# EAGLE design OSSIBeacon (EAGLE 6.1)

## Sheet 1 of 3
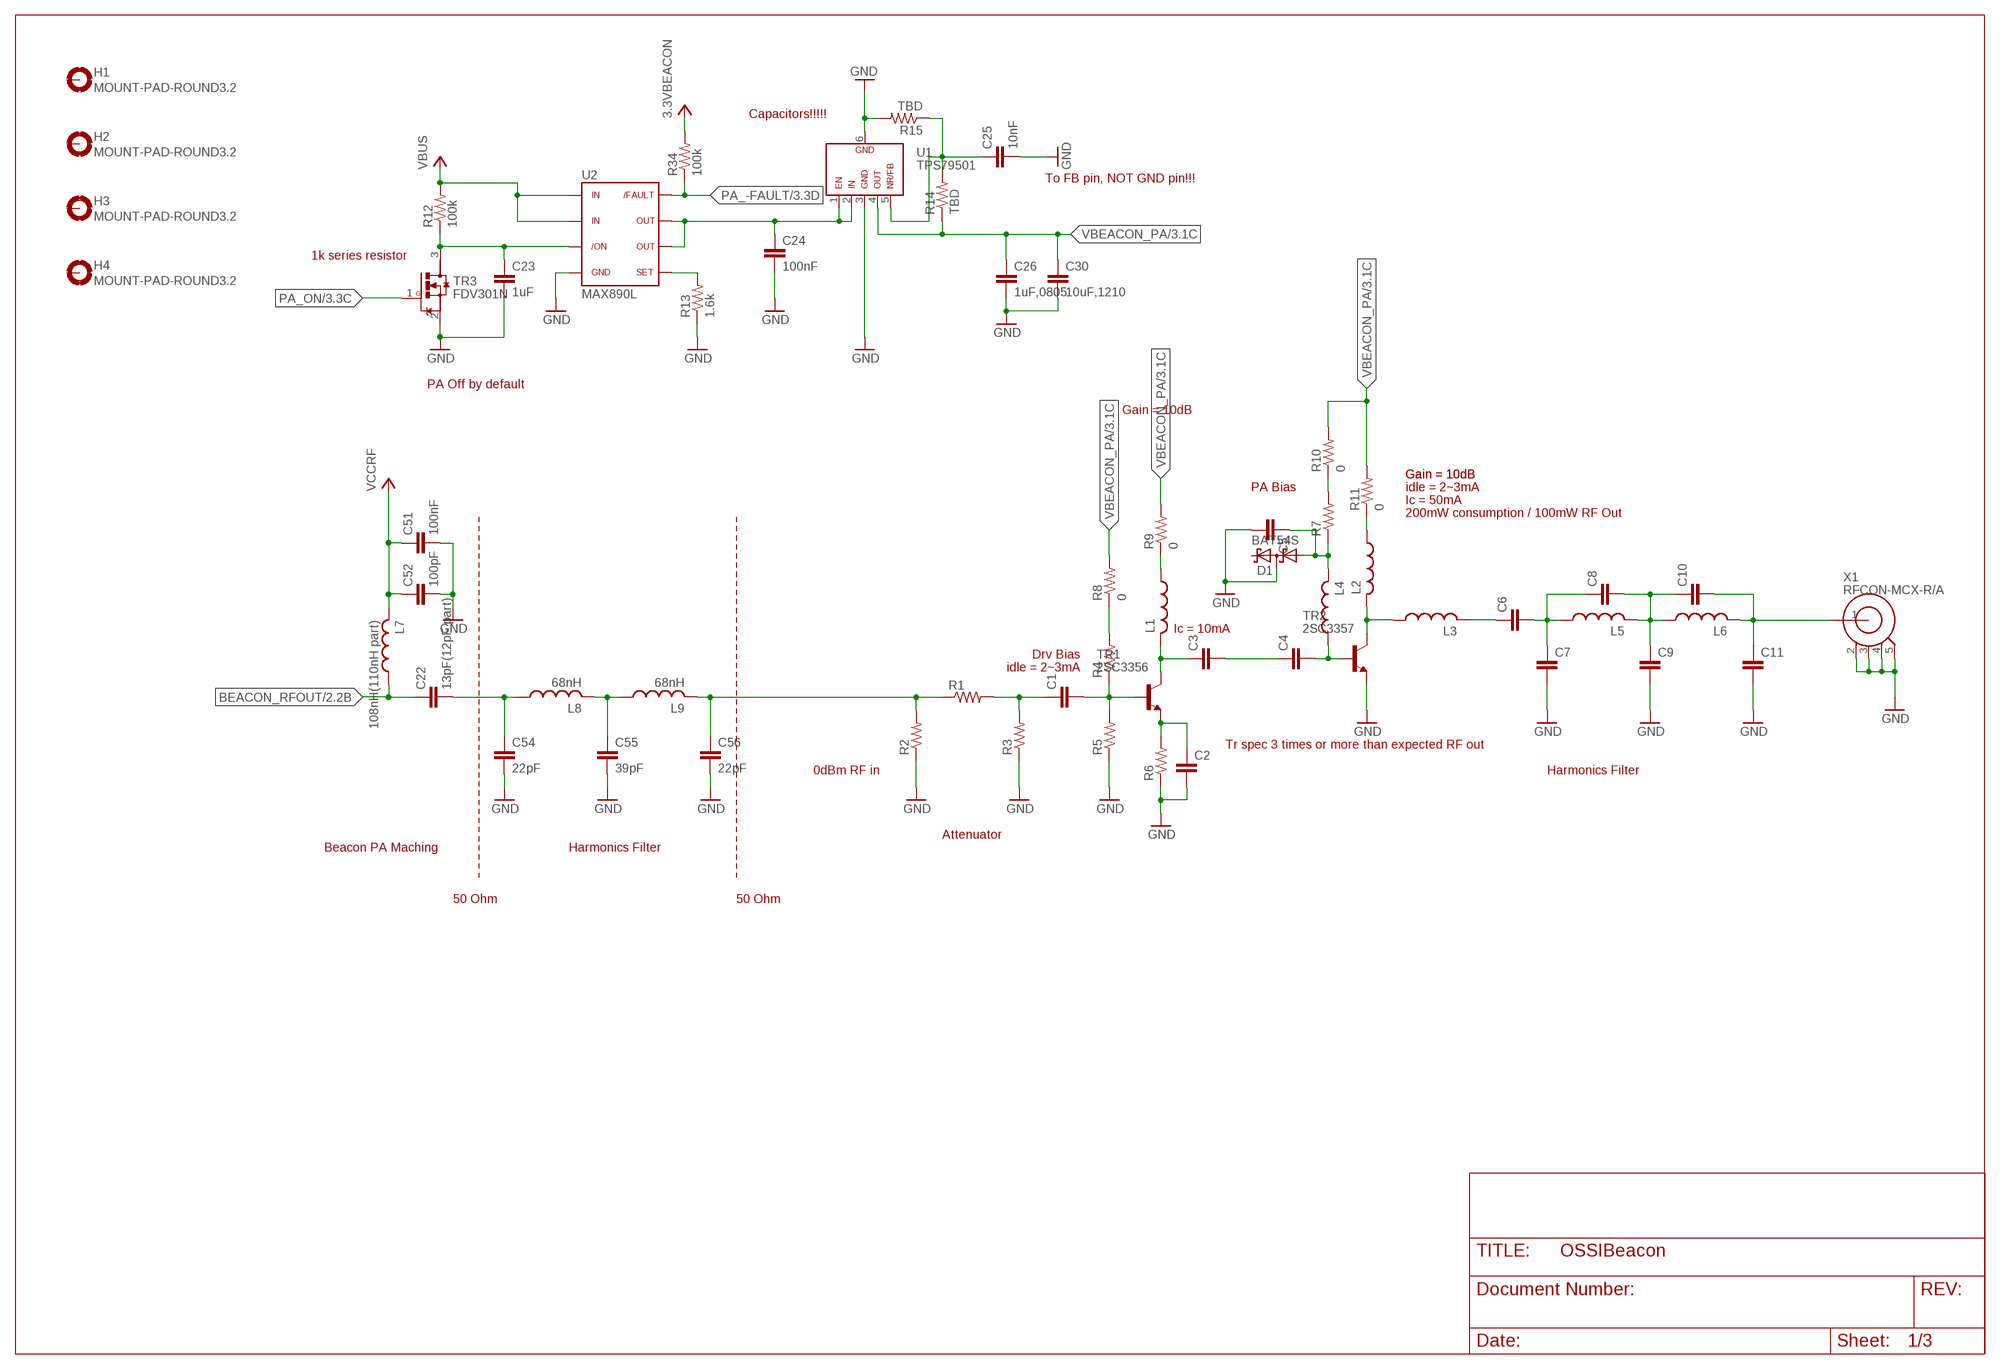
[diagram p0: schematic, sheet 1]

### Parts
C1  C0603(1608)  [C0603(1608)]
C2  C0603(1608)  [C0603(1608)]
C3  C0603(1608)  [C0603(1608)]
C4  C0603(1608)  [C0603(1608)]
C5  C0603(1608)  [C0603(1608)]
C6  C0603(1608)  [C0603(1608)]
C7  C0603(1608)  [C0603(1608)]
C8  C0603(1608)  [C0603(1608)]
C9  C0603(1608)  [C0603(1608)]
C10  C0603(1608)  [C0603(1608)]
C11  C0603(1608)  [C0603(1608)]
C22  13pF(12pF part)  C0603(1608)  [C0603(1608)]
C23  1uF  C0603(1608)  [C0603(1608)]
C24  100nF  C0603(1608)  [C0603(1608)]
C25  10nF  C0603(1608)  [C0603(1608)]
C26  1uF,0805  C0805(2012)  [C0805(2012)]
C30  10uF,1210  C1210(3225)-GCM32  [C1210-GCM32]
C51  100nF  C0603(1608)  [C0603(1608)]
C52  100pF  C0603(1608)  [C0603(1608)]
C54  22pF  C0603(1608)  [C0603(1608)]
C55  39pF  C0603(1608)  [C0603(1608)]
C56  22pF  C0603(1608)  [C0603(1608)]
D1  BAT54S  [SOT23]
H1  MOUNT-PAD-ROUND3.2  [3.2-PAD-ROUND]
H2  MOUNT-PAD-ROUND3.2  [3.2-PAD-ROUND]
H3  MOUNT-PAD-ROUND3.2  [3.2-PAD-ROUND]
H4  MOUNT-PAD-ROUND3.2  [3.2-PAD-ROUND]
L1  L1008(2502)  [L1008(2520)]
L2  L1008(2502)  [L1008(2520)]
L3  L0603(1608)  [L0603(1608)]
L4  L0603(1608)  [L0603(1608)]
L5  L0603(1608)  [L0603(1608)]
L6  L0603(1608)  [L0603(1608)]
L7  108nH(110nH part)  L0603(1608)  [L0603(1608)]
L8  68nH  L0603(1608)  [L0603(1608)]
L9  68nH  L0603(1608)  [L0603(1608)]
R1  R0603(1608)  [R0603(1608)]
R2  R0603(1608)  [R0603(1608)]
R3  R0603(1608)  [R0603(1608)]
R4  R0603(1608)  [R0603(1608)]
R5  R0603(1608)  [R0603(1608)]
R6  R0603(1608)  [R0603(1608)]
R7  R0603(1608)  [R0603(1608)]
R8  0  R0603(1608)  [R0603(1608)]
R9  0  R0603(1608)  [R0603(1608)]
R10  0  R0603(1608)  [R0603(1608)]
R11  0  R0603(1608)  [R0603(1608)]
R12  100k  R0603(1608)  [R0603(1608)]
R13  1.6k  R0603(1608)  [R0603(1608)]
R14  TBD  R0603(1608)  [R0603(1608)]
R15  TBD  R0603(1608)  [R0603(1608)]
R34  100k  R0603(1608)  [R0603(1608)]
TR1  2SC3356  [SOT23-BEC]
TR2  2SC3357  [SOT89-R]
TR3  FDV301N  [SOT23]
U1  TPS79501  [SOT223-6]
U2  MAX890L  [SO8]
X1  RFCON-MCX-R/A  [MCX-R/A]

### Nets
3.3VBEACON: R34.2 ; also sheet 3
BEACON_RFOUT: C22.1 L7.1 ; also sheet 2
GND: C2.2 C5.2 C7.2 C9.2 C11.2 C23.2 C24.2 C25.2 C26.2 C30.P$2 C51.2 C52.2 C54.2 C55.2 C56.2 D1.3(C1A2) R2.1 R3.1 R5.1 R6.1 R13.1 R15.2 TR2.E TR3.2(S) U1.3 U1.6 U2.4 X1.2 X1.3 X1.4 X1.5 ; also sheet 2,3
N$2: C1.1 R1.2 R3.2
N$3: C1.2 R4.1 R5.2 TR1.B
N$4: C3.1 L1.P$2 TR1.C
N$5: C2.1 R6.2 TR1.E
N$6: C3.2 C4.1
N$7: C4.2 L4.1 TR2.B
N$8: C5.1 D1.1(A1) L4.2 R7.1
N$9: L2.P$2 L3.1 TR2.C
N$10: C6.1 L3.2
N$11: C6.2 C7.1 C8.1 L5.1
N$12: C8.2 C9.1 C10.1 L5.2 L6.1
N$13: C10.2 C11.1 L6.2 X1.1
N$14: R4.2 R8.1
N$15: L1.P$1 R9.1
N$16: R7.2 R10.1
N$17: L2.P$1 R11.1
N$18: C25.1 R14.2 R15.1 U1.5
N$19: C23.1 R12.1 TR3.3(D) U2.3
N$20: C24.1 U1.1 U1.2 U2.6 U2.7
N$21: R13.2 U2.5
N$42: C22.2 C54.1 L8.1
N$43: C55.1 L8.2 L9.1
N$44: C56.1 L9.2 R1.1 R2.2
PA_-FAULT: R34.1 U2.8 ; also sheet 3
PA_ON: TR3.1(G) ; also sheet 3
VBEACON_PA: C26.1 C30.P$1 R8.2 R9.2 R10.2 R11.2 R14.1 U1.4 ; also sheet 3
VBUS: R12.2 U2.1 U2.2 ; also sheet 3
VCCRF: C51.1 C52.1 L7.2 ; also sheet 2,3
Unconnected: D1.2(C2) H1.B3,2(MOUNT) H2.B3,2(MOUNT) H3.B3,2(MOUNT) H4.B3,2(MOUNT)

### Notes on the sheet
- Capacitors!!!!!
- To FB pin, NOT GND pin!!!
- 1k series resistor
- PA Off by default
- Gain = 10dB
- Gain = 10dB | Gain = 10dB
- PA Bias | idle = 2~3mA
- Ic = 50mA
- 200mW consumption / 100mW RF Out
- Ic = 10mA
- Drv Bias
- idle = 2~3mA
- Tr spec 3 times or more than expected RF out
- 0dBm RF in | Harmonics Filter
- Attenuator
- Beacon PA Maching | Harmonics Filter
- 50 Ohm | 50 Ohm

## Sheet 2 of 3
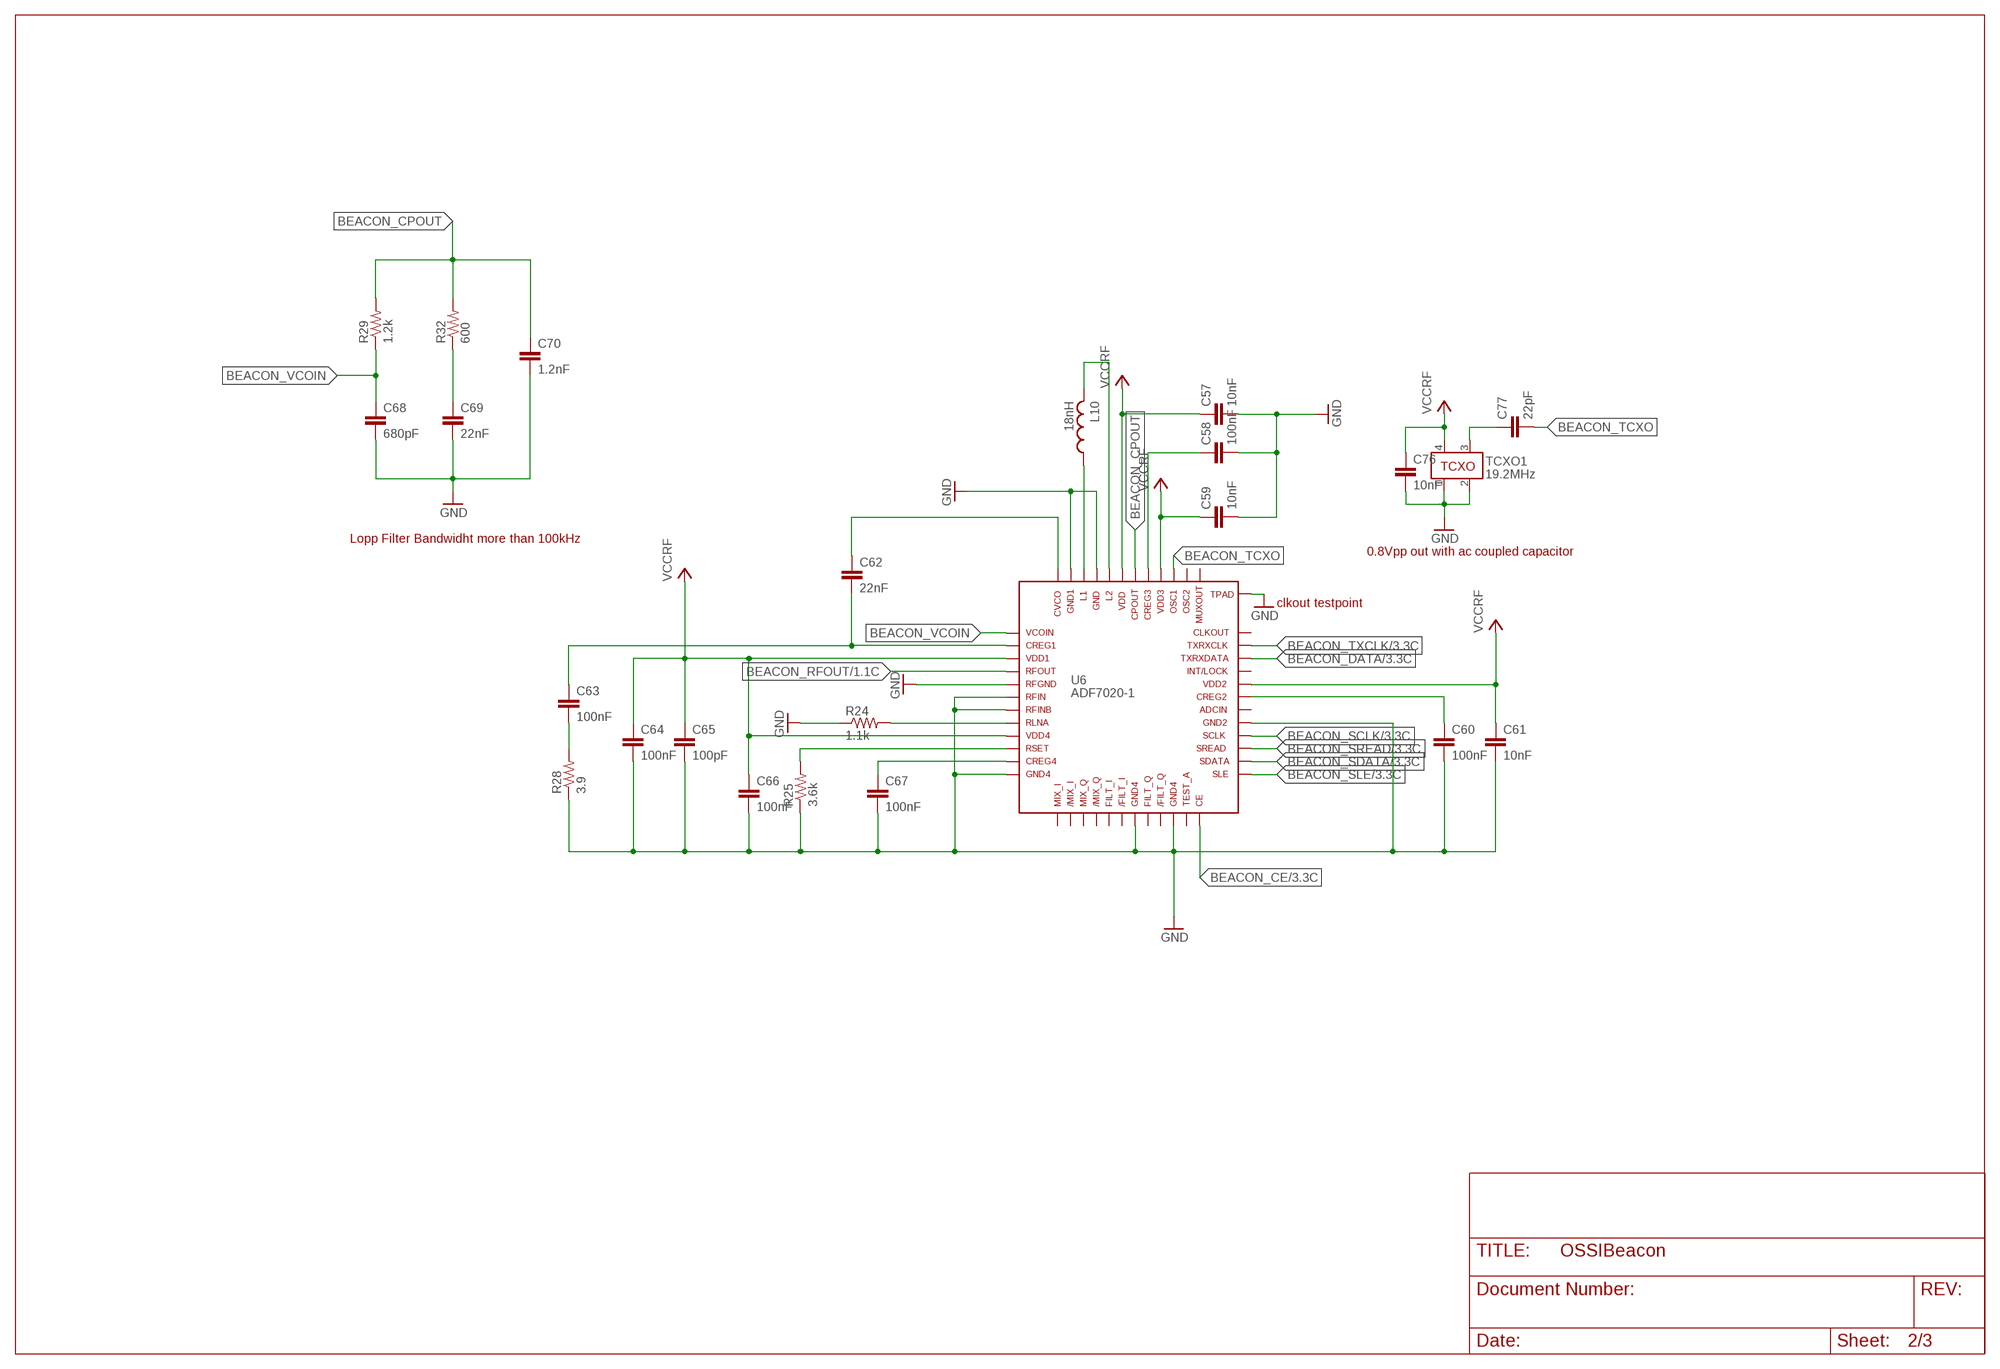
[diagram p1: schematic, sheet 2]

### Parts
C57  10nF  C0603(1608)  [C0603(1608)]
C58  100nF  C0603(1608)  [C0603(1608)]
C59  10nF  C0603(1608)  [C0603(1608)]
C60  100nF  C0603(1608)  [C0603(1608)]
C61  10nF  C0603(1608)  [C0603(1608)]
C62  22nF  C0603(1608)  [C0603(1608)]
C63  100nF  C0603(1608)  [C0603(1608)]
C64  100nF  C0603(1608)  [C0603(1608)]
C65  100pF  C0603(1608)  [C0603(1608)]
C66  100nF  C0603(1608)  [C0603(1608)]
C67  100nF  C0603(1608)  [C0603(1608)]
C68  680pF  C0603(1608)  [C0603(1608)]
C69  22nF  C0603(1608)  [C0603(1608)]
C70  1.2nF  C0603(1608)  [C0603(1608)]
C76  10nF  C0603(1608)  [C0603(1608)]
C77  22pF  C0603(1608)  [C0603(1608)]
L10  18nH  L0603(1608)  [L0603(1608)]
R24  1.1k  R0603(1608)  [R0603(1608)]
R25  3.6k  R0603(1608)  [R0603(1608)]
R28  3.9  R0603(1608)  [R0603(1608)]
R29  1.2k  R0603(1608)  [R0603(1608)]
R32  600  R0603(1608)  [R0603(1608)]
TCXO1  19.2MHz  TCXO-M532  [TCXO_M532]
U6  ADF7020-1  [LFCSP48]

### Nets
BEACON_CE: U6.24 ; also sheet 3
BEACON_CPOUT: C70.1 R29.2 R32.2 U6.42
BEACON_DATA: U6.34 ; also sheet 3
BEACON_RFOUT: U6.4 ; also sheet 1
BEACON_SCLK: U6.28 ; also sheet 3
BEACON_SDATA: U6.26 ; also sheet 3
BEACON_SLE: U6.25 ; also sheet 3
BEACON_SREAD: U6.27 ; also sheet 3
BEACON_TCXO: C77.2 U6.39
BEACON_TXCLK: U6.35 ; also sheet 3
BEACON_VCOIN: C68.1 R29.1 U6.1
GND: C57.2 C58.2 C59.2 C60.2 C61.2 C64.2 C65.2 C66.2 C67.2 C68.2 C69.2 C70.2 C76.2 R24.1 R25.1 R28.1 TCXO1.1 TCXO1.2 U6.5 U6.6 U6.7 U6.12 U6.19 U6.22 U6.29 U6.45 U6.47 U6.EXP ; also sheet 1,3
N$45: C62.1 U6.48
N$46: C63.2 R28.2
N$47: C60.1 U6.31
N$48: C67.1 U6.11
N$49: R25.2 U6.10
N$50: R24.2 U6.8
N$51: C58.1 U6.41
N$52: C62.2 C63.1 U6.2
N$53: C69.1 R32.1
N$54: L10.1 U6.46
N$55: L10.2 U6.44
N$69: C77.1 TCXO1.3
VCCRF: C57.1 C59.1 C61.1 C64.1 C65.1 C66.1 C76.1 TCXO1.4 U6.3 U6.9 U6.32 U6.40 U6.43 ; also sheet 1,3
Unconnected: U6.13 U6.14 U6.15 U6.16 U6.17 U6.18 U6.20 U6.21 U6.23 U6.30 U6.33 U6.36 U6.37 U6.38

### Notes on the sheet
- Lopp Filter Bandwidht more than 100kHz
- 0.8Vpp out with ac coupled capacitor
- clkout testpoint

## Sheet 3 of 3
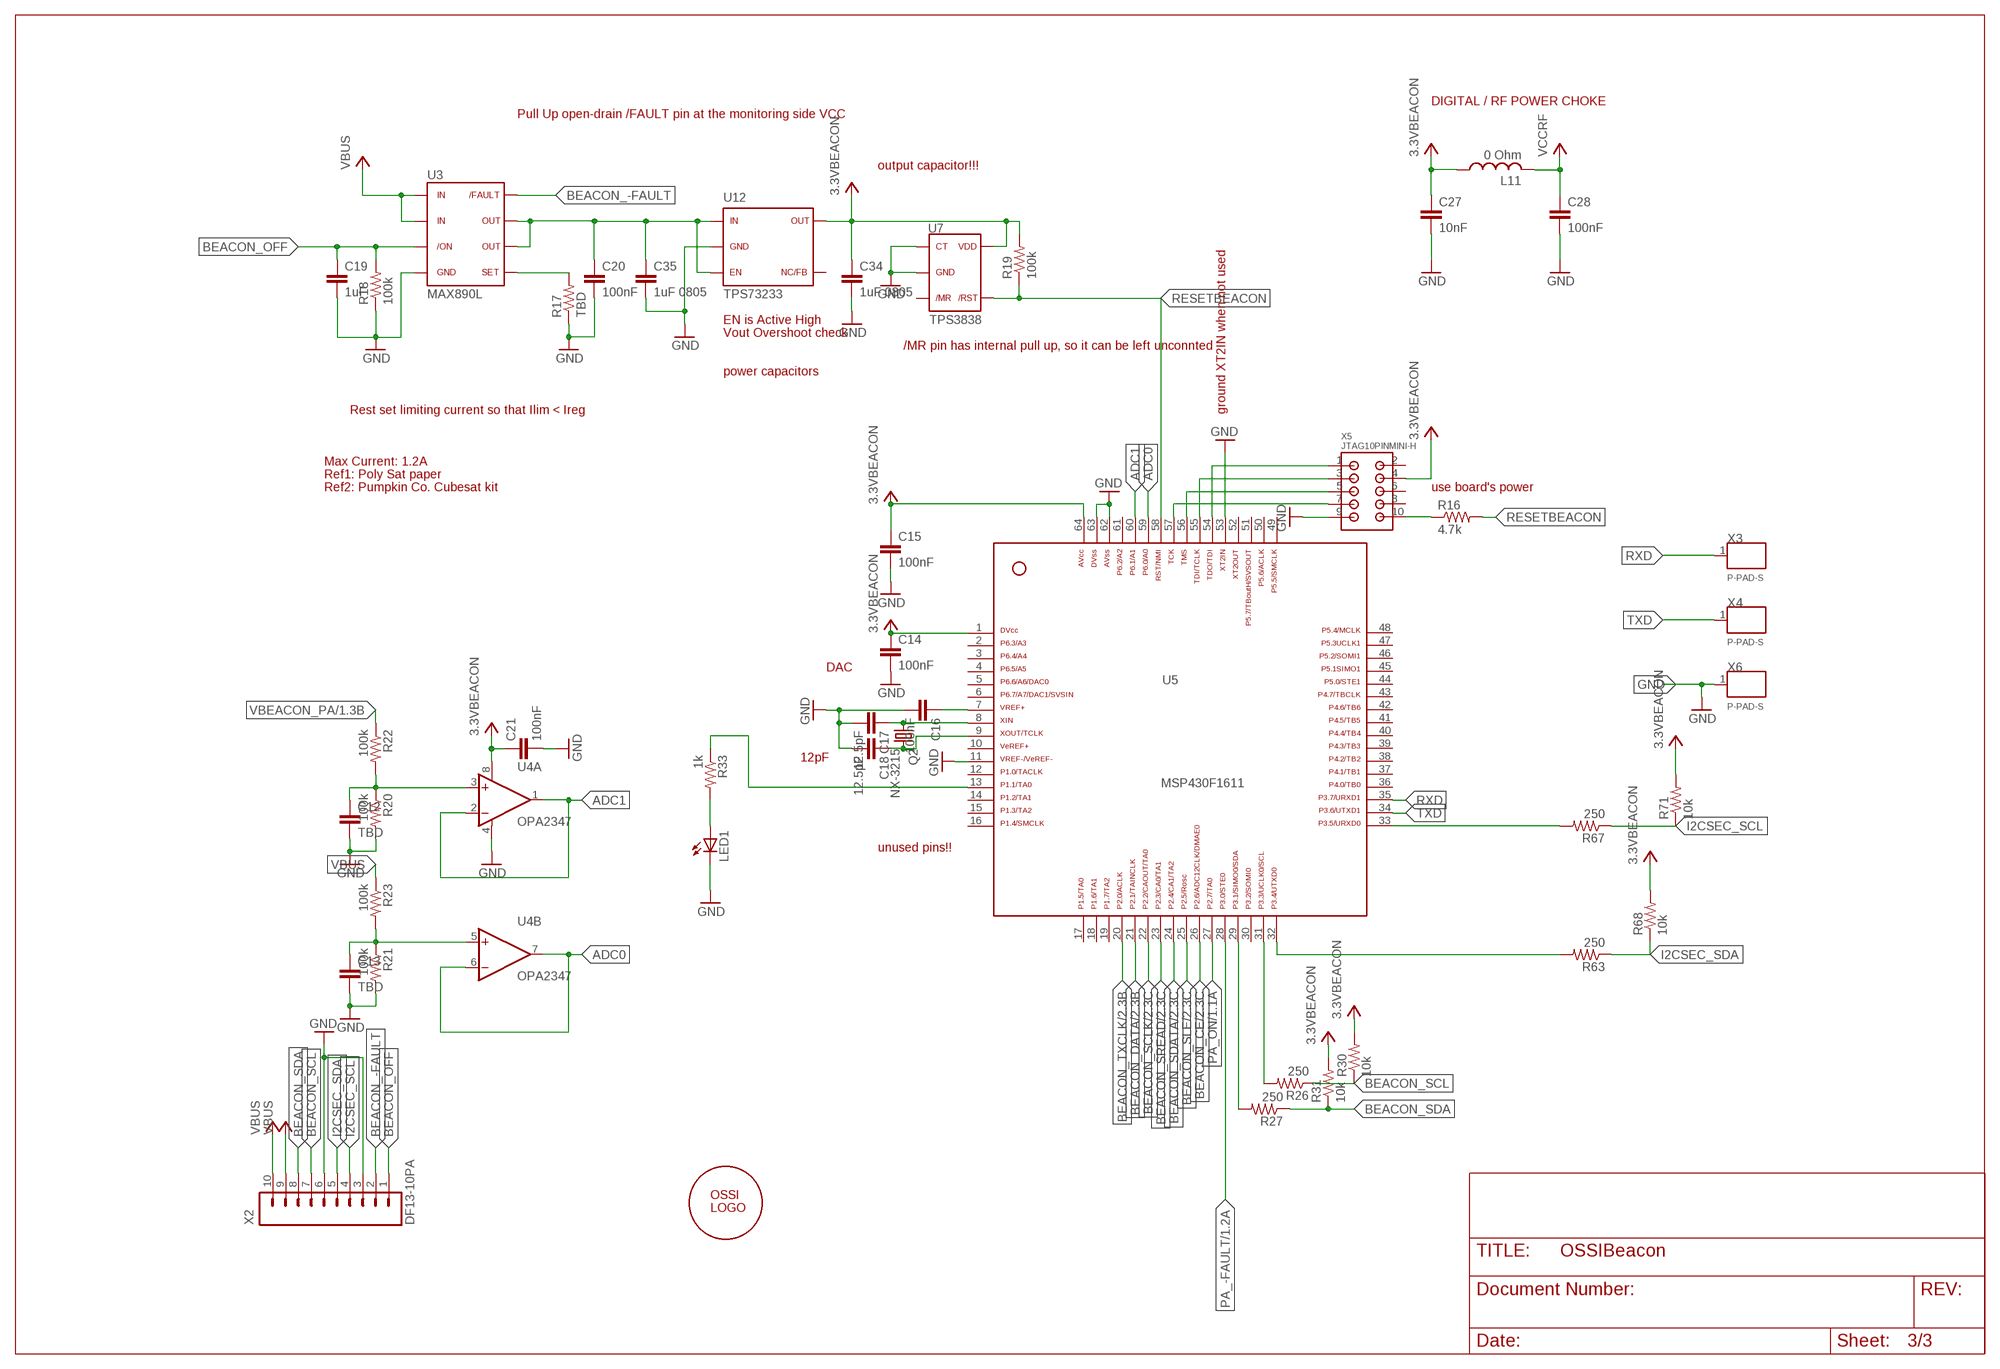
[diagram p2: schematic, sheet 3]

### Parts
C12  TBD  C0603(1608)  [C0603(1608)]
C13  TBD  C0603(1608)  [C0603(1608)]
C14  100nF  C0603(1608)  [C0603(1608)]
C15  100nF  C0603(1608)  [C0603(1608)]
C16  100nF  C0603(1608)  [C0603(1608)]
C17  12.5pF  C0603(1608)  [C0603(1608)]
C18  12.5pF  C0603(1608)  [C0603(1608)]
C19  1uF  C0603(1608)  [C0603(1608)]
C20  100nF  C0603(1608)  [C0603(1608)]
C21  100nF  C0603(1608)  [C0603(1608)]
C27  10nF  C0603(1608)  [C0603(1608)]
C28  100nF  C0603(1608)  [C0603(1608)]
C34  1uF 0805  C0805(2012)  [C0805(2012)]
C35  1uF 0805  C0805(2012)  [C0805(2012)]
L11  0 Ohm  L0805(2012)  [L0805(2012)]
LED1  LED0603  [LED-0603]
Q2  NX-3215  [NX-3215]
R16  4.7k  R0603(1608)  [R0603(1608)]
R17  TBD  R0603(1608)  [R0603(1608)]
R18  100k  R0603(1608)  [R0603(1608)]
R19  100k  R0603(1608)  [R0603(1608)]
R20  100k  R0603(1608)  [R0603(1608)]
R21  100k  R0603(1608)  [R0603(1608)]
R22  100k  R0603(1608)  [R0603(1608)]
R23  100k  R0603(1608)  [R0603(1608)]
R26  250  R0603(1608)  [R0603(1608)]
R27  250  R0603(1608)  [R0603(1608)]
R30  10k  R0603(1608)  [R0603(1608)]
R31  10k  R0603(1608)  [R0603(1608)]
R33  1k  R0603(1608)  [R0603(1608)]
R63  250  R0603(1608)  [R0603(1608)]
R67  250  R0603(1608)  [R0603(1608)]
R68  10k  R0603(1608)  [R0603(1608)]
R71  10k  R0603(1608)  [R0603(1608)]
U3  MAX890L  [SO8]
U4  OPA2347  [SOT23-8DCN]
U5  MSP430F1611  [PM/PAG64]
U7  TPS3838  [SOT23-5DBV]
U12  TPS73233  [SOT23-5DBV]
U$1  OSSILOGORECT  [OSSILOGORECT1005]
X2  DF13-10PA  [DF13A-10P]
X3  P-PAD-S  [P-PAD-S]
X4  P-PAD-S  [P-PAD-S]
X5  JTAG10PINMINI-H  [M50-3200545]
X6  P-PAD-S  [P-PAD-S]

### Nets
3.3VBEACON: C14.1 C15.1 C21.1 C27.1 C34.1 L11.1 R19.2 R30.2 R31.2 R68.2 R71.2 U4.8(A:V+) U5.1 U5.64 U7.5 U12.5 X5.4 ; also sheet 1
ADC0: U4.6(B:-IN) U4.7(B:OUT) U5.59
ADC1: U4.1(A:OUT) U4.2(A:-IN) U5.60
BEACON_-FAULT: U3.8 X2.2
BEACON_CE: U5.26 ; also sheet 2
BEACON_DATA: U5.21 ; also sheet 2
BEACON_OFF: C19.1 R18.2 U3.3 X2.1
BEACON_SCL: R26.1 R30.1 X2.7
BEACON_SCLK: U5.22 ; also sheet 2
BEACON_SDA: R27.1 R31.1 X2.8
BEACON_SDATA: U5.24 ; also sheet 2
BEACON_SLE: U5.25 ; also sheet 2
BEACON_SREAD: U5.23 ; also sheet 2
BEACON_TXCLK: U5.20 ; also sheet 2
GND: C12.2 C13.2 C14.2 C15.2 C16.2 C17.2 C18.2 C19.2 C20.2 C21.2 C27.2 C28.2 C34.2 C35.2 LED1.C R17.1 R18.1 R20.2 R21.2 U3.4 U4.4(A:V-) U5.11 U5.53 U5.62 U5.63 U7.1 U7.2 U12.2 X2.3 X2.6 X5.9 X6.1 ; also sheet 1,2
I2CSEC_SCL: R67.1 R71.1 X2.4
I2CSEC_SDA: R63.1 R68.1 X2.5
N$1: LED1.A R33.2
N$22: C13.1 R21.1 R23.2 U4.5(B:+IN)
N$23: C16.1 U5.7
N$24: R33.1 U5.13
N$25: C17.1 Q2.1 U5.8
N$26: C18.1 Q2.2 U5.9
N$27: U5.57 X5.7
N$28: U5.56 X5.5
N$29: U5.55 X5.3
N$30: U5.54 X5.1
N$31: R16.1 X5.10
N$32: R17.2 U3.5
N$33: C12.1 R20.1 R22.2 U4.3(A:+IN)
N$59: R67.2 U5.33
N$60: R27.2 U5.29
N$61: R26.2 U5.31
N$64: R63.2 U5.32
N$666: C20.1 C35.1 U3.6 U3.7 U12.1 U12.3
PA_-FAULT: U5.28 ; also sheet 1
PA_ON: U5.27 ; also sheet 1
RESETBEACON: R16.2 R19.1 U5.58 U7.4
RXD: U5.35 X3.1
TXD: U5.34 X4.1
VBEACON_PA: R22.1 ; also sheet 1
VBUS: R23.1 U3.1 U3.2 X2.9 X2.10 ; also sheet 1
VCCRF: C28.1 L11.2 ; also sheet 1,2
Unconnected: U5.2 U5.3 U5.4 U5.5 U5.6 U5.10 U5.12 U5.14 U5.15 U5.16 U5.17 U5.18 U5.19 U5.30 U5.36 U5.37 U5.38 U5.39 U5.40 U5.41 U5.42 U5.43 U5.44 U5.45 U5.46 U5.47 U5.48 U5.49 U5.50 U5.51 U5.52 U5.61 U7.3 U12.4 X5.2 X5.6 X5.8

### Notes on the sheet
- DIGITAL / RF POWER CHOKE
- Pull Up open-drain /FAULT pin at the monitoring side VCC
- output capacitor!!!
- EN is Active High
- Vout Overshoot check
- /MR pin has internal pull up, so it can be left unconnted
- power capacitors
- Rest set limiting current so that Ilim < Ireg | ground XT2IN when not used
- Max Current: 1.2A
- Ref1: Poly Sat paper
- Ref2: Pumpkin Co. Cubesat kit | use board's power
- DAC
- 12pF
- unused pins!!

## Library data of the parts
C1-C28 C30 C34 C35 C51 C52 C54-C70 C76 C77 = OSSI:C
D1 = OSSI:BAT54S: Schottky Diodes Pin connection corrected 2011-05-04 Source: Fairchild .. BAT54.pdf
H1-H4 = OSSI:MOUNT-PAD-ROUND
L1-L11 = OSSI:L
LED1 = SparkFun:LED: LEDs Standard schematic elements and footprints for 5mm, 3mm, 1206, and 0603 sized LEDs. 5mm - Spark Fun Electronics SKU : COM-00529 (and others)
Q2 = OSSI:NX-3215: NDK 32.768 kHz SMD Crystal P/N: NX3215SA-32.768K-STD-MUA-9 Nominal frequency (kHz): 32.768 Package Size (L×W×H : mm): 3.2×1.5×0.8 Operating Temperature Range(*1) / Storage Temperature Range (°C): -40 to +85 / -40 to +85 Level of drive: 0.1µW (Max. 0.5µW) Frequency Tolerance (25±3°C): ±20×10-6 Load Capacitance: 9.0pF, 12.5pF Equivalent Series Resistance: 70kΩ Max. Ordering Code: NX3215SA-32.768K-STD-MUA-9 (Load Capacitance9.0pF) /NX3215SA-32.768K-STD-MUA-8 (Load Capacitance12.5pF)
R1-R34 R63 R67 R68 R71 = OSSI:R
TCXO1 = OSSI:TCXO-M532: 532L25DT19M2000: CTO electronic components Model 532 19.2MHz TCXO for RF transeiver Clipped Sine Wave Output Operating Voltage, +3.3Vdc Operating Temperature to -30°C to +85°C Frequency Stability: ±2.5ppm
TR1 = OSSI:2SC3356
TR2 = OSSI:2SC3357
TR3 = OSSI:FDV301N: FDV301N Digital N channel - FET / Rdson = 5 Ohm / Vgs = 0.7~1.06V / Ids = 220mA
U1 = OSSI:TPS795*: TPS795xx ULTRALOW-NOISE, HIGH-PSRR, FAST, RF, 500-mA LOW-DROPOUT LINEAR REGULATORS
U2 U3 = OSSI:MAX890L: MAX 890L 1.2A, Current-Limited, High-Side P-Channel Switch with Thermal Shutdown BY MAXIM
U4 = OSSI:OPA2347: OPA2347 RAIL-TO-RAIL INPUT AND OUTPUT SINGLE SUPPLY: 2.3V to 5.5V LOW IQ: 20µ
U5 = OSSI:MSP430F1611: MSP430F1611
U6 = OSSI:ADF7020-1: ADF7020-1 RF transceiver by analog device
U7 = OSSI:TPS3838: TPS3838 NanoPower Supervisory IC from texas instruments. TPS3838 is open-drain output
U12 = OSSI:TPS732*: TPS732XX LDO 250mA / 40mV drop out EN pin is Active High!!
U$1 = OSSI:OSSILOGO
X1 = OSSI:RFCON: RF Connectors
X2 = OSSI:DF13-10P
X3 X4 X6 = OSSI:P-PAD
X5 = OSSI:JTAG10PINMINI

## Board
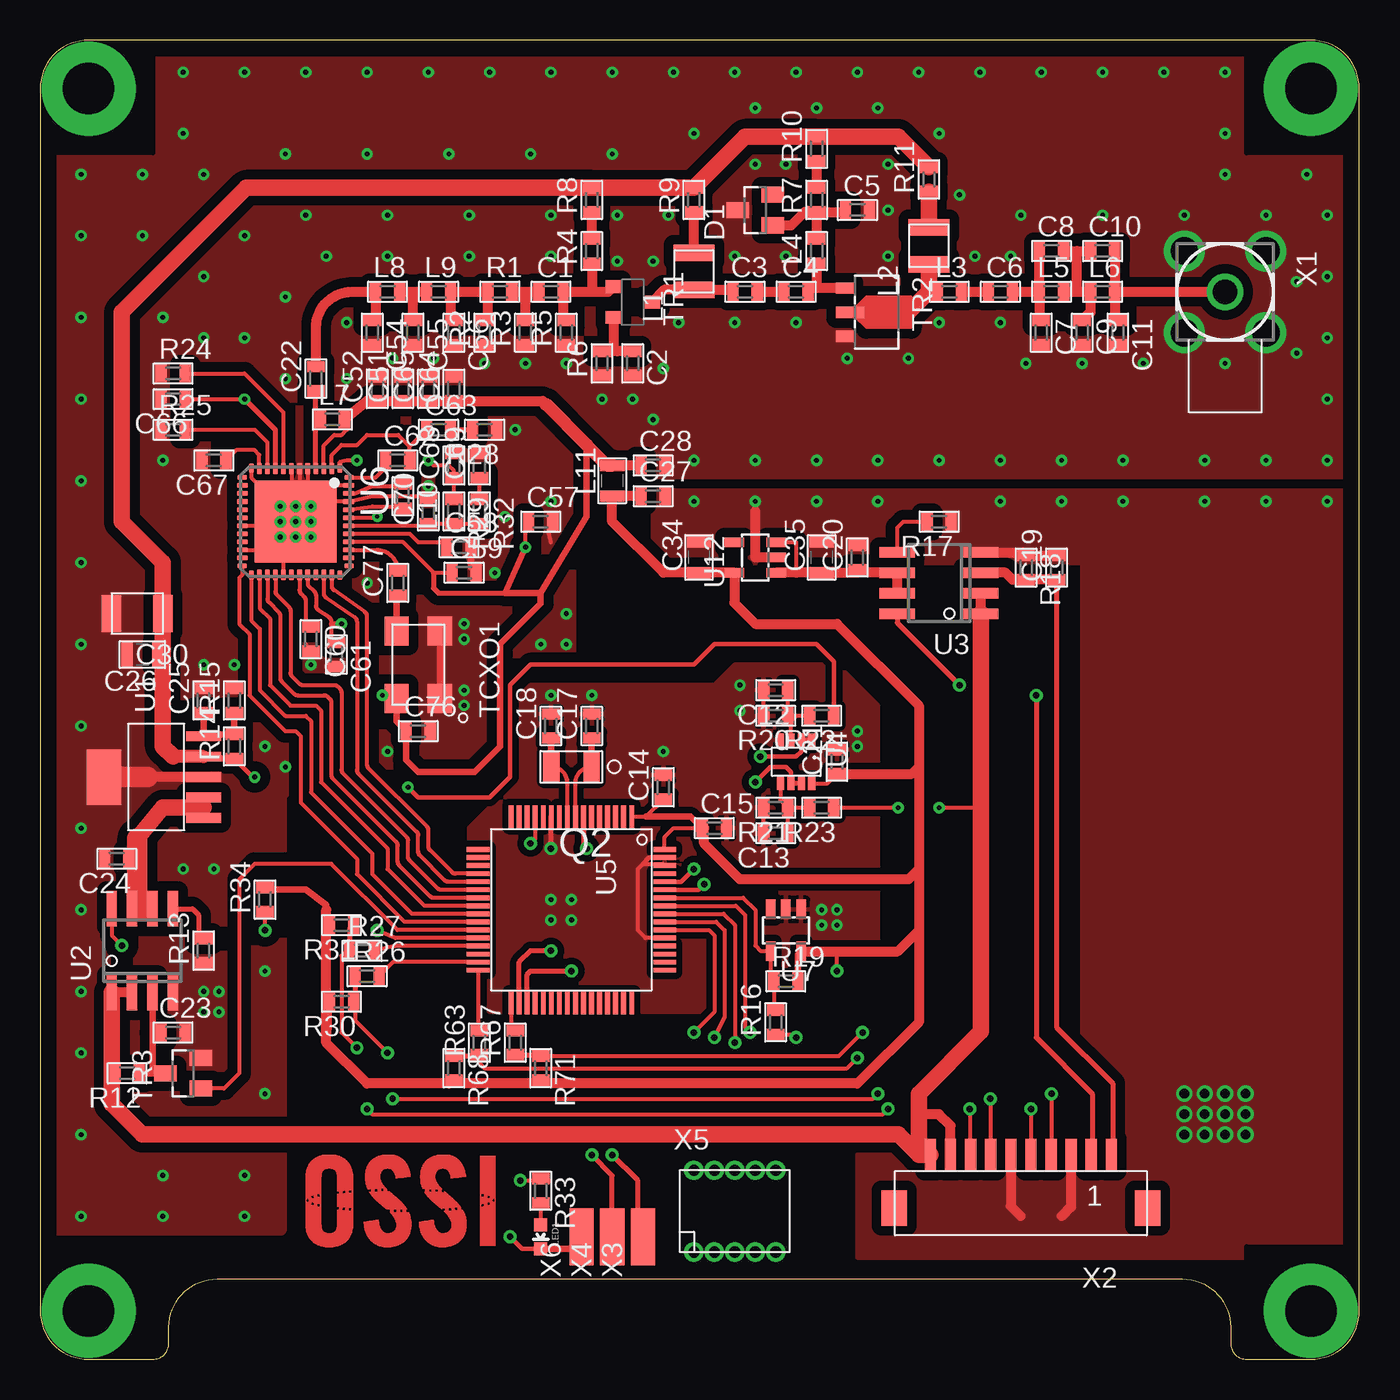
[diagram p3: board, top side]
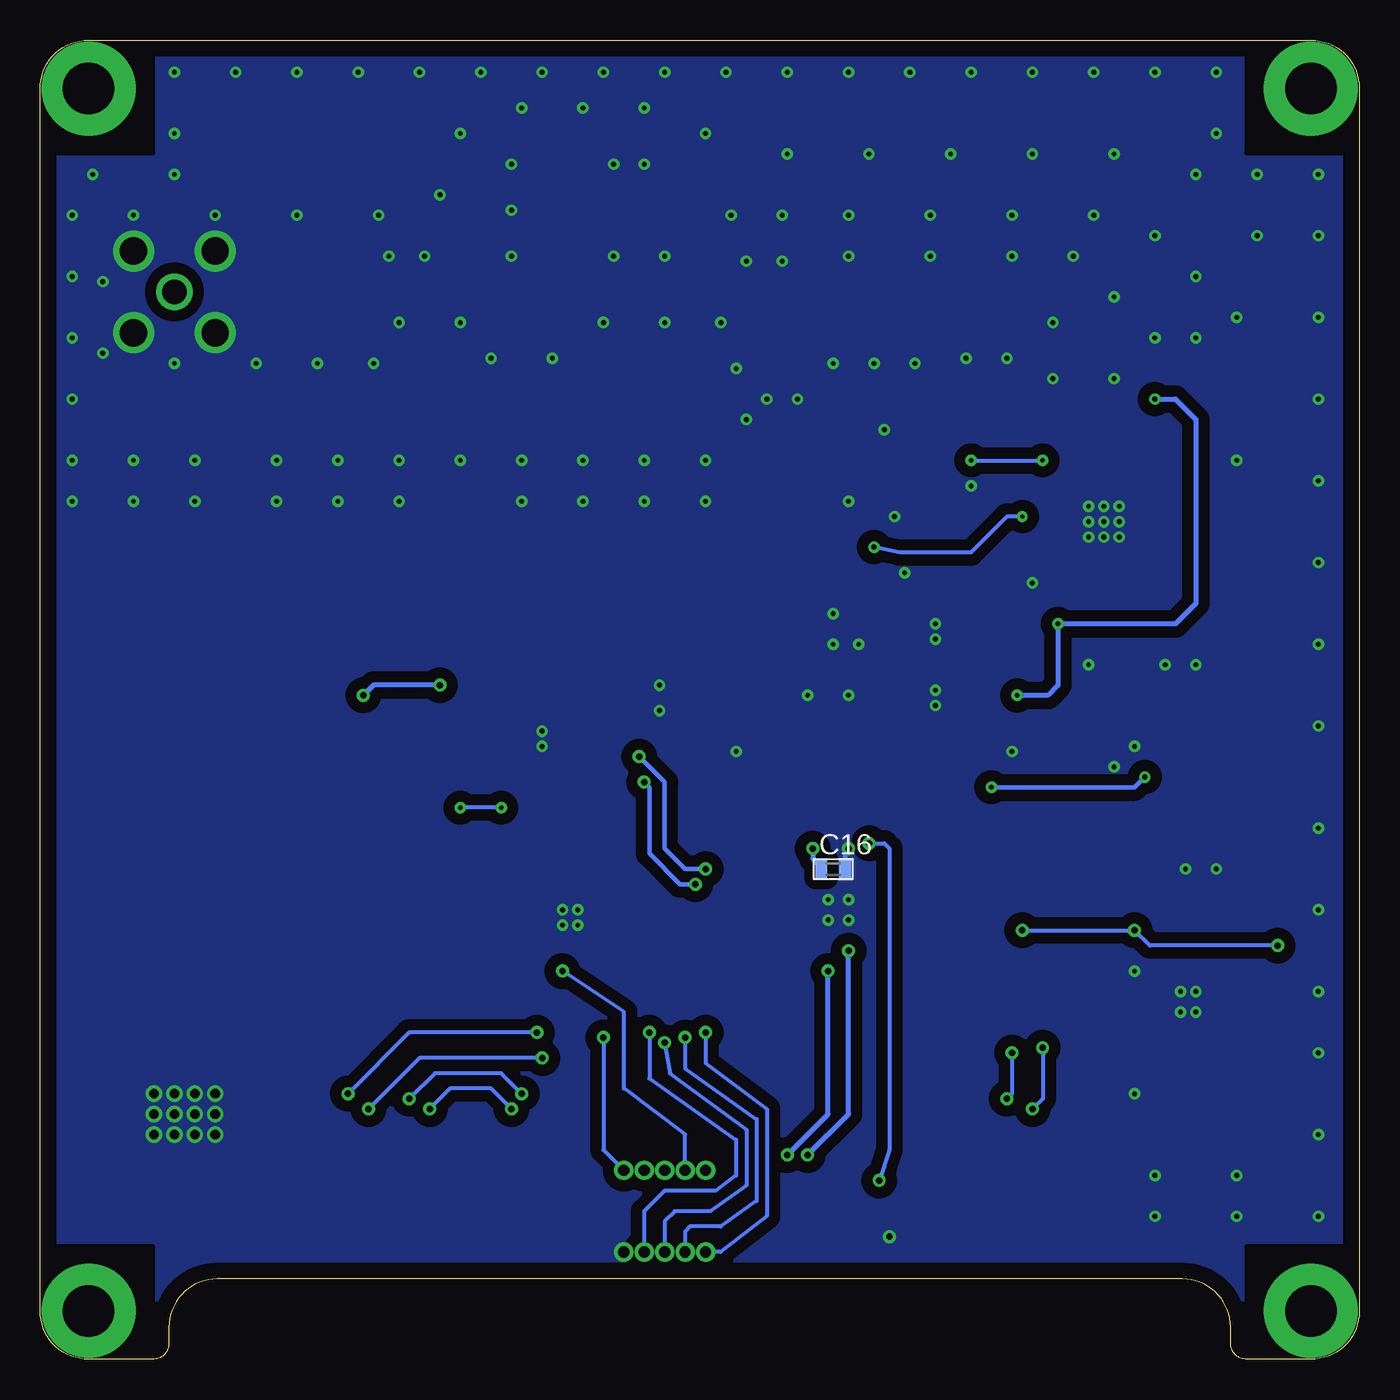
[diagram p4: board, bottom side, seen from below]

Size 82 x 82 mm. Coordinates in mm from the lower left corner, seen from the top.
Outline: 79,82 3,82 arc90 0,79 0,3 arc90 3,0 7,0 arc90 8,1 8,2 arc-90 11,5 71,5 arc-90 74,2 74,1 arc90 75,0 79,0 arc90 82,3 82,79 arc90 79,82
Copper layers (1*16): Top 0.035mm / dielectric 1.5mm / Bottom 0.035mm
Design rules: minimum track width 10mil, minimum drill 24mil, track to track 8mil, track to pad 8mil, pad to pad 8mil, via to via 8mil, smd to smd 8mil, copper to edge 40mil, drill to drill 8mil, minimum pad ring 10mil, minimum via ring 8mil, stop-mask expansion 4mil, vias tented up to drill 0mil, thermal gap 10mil

### Footprints (pad centres in the part's own frame; a part is rotated, then mirrored left to right if it is on the bottom)
C0603(1608) = smd 0.7 x 1.1: 1 -0.75,0; 2 0.75,0
C0805(2012) = smd 0.7 x 1.5: 1 -0.95,0; 2 0.95,0
C1210-GCM32 = smd 1.2 x 2.3: P$1 -1.6,0; P$2 1.6,0
SOT23 = smd 1 x 1.4: 1 -0.95,-1.1; 2 0.95,-1.1; 3 0,1.1
3.2-PAD-ROUND = drill 3.2 pad 5.842: B3,2 0,0
L1008(2520) = smd 2.54 x 1.02: P$1 0,1.145; P$2 0,-1.145
L0603(1608) = smd 0.7 x 1.1: 1 -0.75,0; 2 0.75,0
L0805(2012) = smd 0.7 x 1.5: 1 -0.95,0; 2 0.95,0
LED-0603 = smd 0.8 x 0.8: A 0,-0.75; C 0,0.75
NX-3215 = smd 1 x 1.8: 1 -1.25,0; 2 1.25,0
R0603(1608) = smd 0.7 x 1.1: 1 -0.75,0; 2 0.75,0
TCXO_M532 = smd 1.8 x 1.5: 1 -2.1,-1.35; 2 2.1,-1.35; 3 2.1,1.35; 4 -2.1,1.35
SOT23-BEC = smd 0.8 x 1: B -0.95,-1.2; C 0,1.2; E 0.95,-1.2
SOT89-R = smd 0.7 x 1.1: B -1.5,-1.75; E 1.5,-1.75 | smd 0.7 x 1.8: C 0,-1.4
SOT223-6 = smd 0.6 x 2.2: 1 -2.54,0; 2 -1.27,0; 3 0,0; 4 1.27,0; 5 2.54,0 | smd 3.45 x 2.15: 6 0,6.2
SO8 = smd 0.65 x 2.2: 1 -1.905,-2.6; 2 -0.635,-2.6; 3 0.635,-2.6; 4 1.905,-2.6; 5 1.905,2.6; 6 0.635,2.6; 7 -0.635,2.6; 8 -1.905,2.6
SOT23-8DCN = smd 0.45 x 0.8: 1 -0.975,-1.35; 2 -0.325,-1.35; 3 0.325,-1.35; 4 0.975,-1.35; 5 0.975,1.35; 6 0.325,1.35; 7 -0.325,1.35; 8 -0.975,1.35
PM/PAG64 = smd 1.4 x 0.3: 1 -5.8,3.75; 2 -5.8,3.25; 3 -5.8,2.75; 4 -5.8,2.25; 5 -5.8,1.75; 6 -5.8,1.25; 7 -5.8,0.75; 8 -5.8,0.25; 9 -5.8,-0.25; 10 -5.8,-0.75; 11 -5.8,-1.25; 12 -5.8,-1.75; 13 -5.8,-2.25; 14 -5.8,-2.75; 15 -5.8,-3.25; 16 -5.8,-3.75; 33 5.8,-3.75; 34 5.8,-3.25; 35 5.8,-2.75; 36 5.8,-2.25; 37 5.8,-1.75; 38 5.8,-1.25; 39 5.8,-0.75; 40 5.8,-0.25; 41 5.8,0.25; 42 5.8,0.75; 43 5.8,1.25; 44 5.8,1.75; 45 5.8,2.25; 46 5.8,2.75; 47 5.8,3.25; 48 5.8,3.75 | smd 0.3 x 1.4: 17 -3.75,-5.8; 18 -3.25,-5.8; 19 -2.75,-5.8; 20 -2.25,-5.8; 21 -1.75,-5.8; 22 -1.25,-5.8; 23 -0.75,-5.8; 24 -0.25,-5.8; 25 0.25,-5.8; 26 0.75,-5.8; 27 1.25,-5.8; 28 1.75,-5.8; 29 2.25,-5.8; 30 2.75,-5.8; 31 3.25,-5.8; 32 3.75,-5.8; 49 3.75,5.8; 50 3.25,5.8; 51 2.75,5.8; 52 2.25,5.8; 53 1.75,5.8; 54 1.25,5.8; 55 0.75,5.8; 56 0.25,5.8; 57 -0.25,5.8; 58 -0.75,5.8; 59 -1.25,5.8; 60 -1.75,5.8; 61 -2.25,5.8; 62 -2.75,5.8; 63 -3.25,5.8; 64 -3.75,5.8
LFCSP48 = smd 0.6 x 0.32: 1 -3.325,2.75; 12 -3.325,-2.75; 25 3.325,-2.75; 36 3.325,2.75 | smd 0.7 x 0.32: 2 -3.3,2.25; 3 -3.3,1.75; 4 -3.3,1.25; 5 -3.3,0.75; 6 -3.3,0.25; 7 -3.3,-0.25; 8 -3.3,-0.75; 9 -3.3,-1.25; 10 -3.3,-1.75; 11 -3.3,-2.25; 26 3.3,-2.25; 27 3.3,-1.75; 28 3.3,-1.25; 29 3.3,-0.75; 30 3.3,-0.25; 31 3.3,0.25; 32 3.3,0.75; 33 3.3,1.25; 34 3.3,1.75; 35 3.3,2.25 | smd 0.32 x 0.6: 13 -2.75,-3.325; 24 2.75,-3.325; 37 2.75,3.325; 48 -2.75,3.325 | smd 0.32 x 0.7: 14 -2.25,-3.3; 15 -1.75,-3.3; 16 -1.25,-3.3; 17 -0.75,-3.3; 18 -0.25,-3.3; 19 0.25,-3.3; 20 0.75,-3.3; 21 1.25,-3.3; 22 1.75,-3.3; 23 2.25,-3.3; 38 2.25,3.3; 39 1.75,3.3; 40 1.25,3.3; 41 0.75,3.3; 42 0.25,3.3; 43 -0.25,3.3; 44 -0.75,3.3; 45 -1.25,3.3; 46 -1.75,3.3; 47 -2.25,3.3 | smd 5.1 x 5.1: EXP 0,0
SOT23-5DBV = smd 0.6 x 1.22: 1 -0.95,-1.3; 2 0,-1.3; 3 0.95,-1.3; 4 0.95,1.3; 5 -0.95,1.3
MCX-R/A = drill 1.5: 1 0,0 | drill 1.7: 2 -2.54,2.54; 3 2.54,2.54; 4 2.54,-2.54; 5 -2.54,-2.54
DF13A-10P = smd 0.7 x 2: 1 -5.625,0; 2 -4.375,0; 3 -3.125,0; 4 -1.875,0; 5 -0.625,0; 6 0.625,0; 7 1.875,0; 8 3.125,0; 9 4.375,0; 10 5.625,0 | smd 1.6 x 2.2: P$1 -7.875,3.3; P$2 7.875,3.3
P-PAD-S = smd 3.556 x 1.5: 1 0,0
M50-3200545 = drill 0.7 pad 1: 1 -2.54,-2.54; 2 -2.54,2.54; 3 -1.27,-2.54; 4 -1.27,2.54; 5 0,-2.54; 6 0,2.54; 7 1.27,-2.54; 8 1.27,2.54; 9 2.54,-2.54; 10 2.54,2.54

### Placement (x,y rotation side)
C1  31.75,66.36 0 top
C2  36.83,61.91 270 top
C3  43.81,66.36 0 top
C4  46.99,66.36 0 top
C5  50.8,71.44 0 top
C6  59.69,66.36 0 top
C7  62.23,63.82 270 top
C8  62.87,68.9 0 top
C9  64.77,63.82 270 top
C10  66.04,68.9 0 top
C11  66.99,63.82 270 top
C12  45.72,41.59 180 top
C13  45.72,32.7 180 top
C14  38.73,35.56 90 top
C15  41.91,33.02 0 top
C16  32.7,30.48 0 bottom
C17  34.29,39.37 90 top
C18  31.75,39.37 90 top
C19  63.18,49.21 90 top
C20  50.8,49.85 90 top
C21  49.53,37.15 90 top
C22  17.14,60.96 90 top
C23  8.26,20.32 0 top
C24  4.76,31.11 180 top
C25  10.16,40.96 90 top
C26  6.35,43.81 180 top
C27  38.1,53.66 0 top
C28  38.1,55.56 0 top
C30  6.03,46.35 180 top
C34  40.96,49.85 90 top
C35  48.58,49.85 90 top
C51  22.54,60.33 90 top
C52  20.95,60.33 90 top
C54  20.64,63.82 270 top
C55  23.18,63.82 270 top
C56  25.72,63.82 270 top
C57  31.11,52.07 0 top
C58  26.04,50.48 0 top
C59  26.35,48.9 0 top
C60  16.83,44.77 270 top
C61  18.41,43.81 270 top
C62  22.23,55.88 0 top
C63  24.77,57.78 0 top
C64  25.72,60.33 90 top
C65  24.13,60.33 90 top
C66  8.26,59.69 180 top
C67  10.79,55.88 180 top
C68  25.72,55.56 90 top
C69  27.3,55.56 90 top
C70  24.13,52.7 90 top
C76  23.5,39.05 0 top
C77  22.23,48.26 90 top
D1  44.45,71.44 90 top
H1  3,3 0 top
H2  3,79 0 top
H3  79,79 0 top
H4  79,3 0 top
L1  40.64,67.63 0 top
L2  55.24,69.22 0 top
L3  56.52,66.36 0 top
L4  48.26,68.9 90 top
L5  62.87,66.36 0 top
L6  66.04,66.36 0 top
L7  18.16,58.42 0 top
L8  21.59,66.36 0 top
L9  24.77,66.36 0 top
L10  22.54,53.66 270 top
L11  35.56,54.61 90 top
LED1  31.11,7.62 180 top
Q2  33.02,36.83 180 top
R1  28.57,66.36 0 top
R2  27.62,63.82 90 top
R3  30.16,63.82 90 top
R4  34.29,68.9 90 top
R5  32.7,63.82 90 top
R6  34.92,61.91 90 top
R7  48.26,72.07 90 top
R8  34.29,72.07 90 top
R9  40.64,72.07 90 top
R10  48.26,75.25 90 top
R11  55.24,73.34 90 top
R12  5.4,17.78 180 top
R13  10.16,25.4 90 top
R14  12.06,38.1 90 top
R15  12.06,40.96 90 top
R16  45.72,20.95 90 top
R17  55.88,52.07 180 top
R18  61.28,49.21 270 top
R19  46.35,23.5 0 top
R20  45.72,40.01 180 top
R21  45.72,34.29 180 top
R22  48.58,40.01 180 top
R23  48.58,34.29 180 top
R24  8.26,61.28 0 top
R25  8.26,57.78 0 top
R26  20.32,23.81 0 top
R27  20,25.4 0 top
R28  27.62,57.78 180 top
R29  25.72,52.7 270 top
R30  18.73,22.23 180 top
R31  18.73,26.99 180 top
R32  27.3,52.7 270 top
R33  31.11,10.48 270 top
R34  13.97,28.57 90 top
R63  27.3,19.68 90 top
R67  29.53,19.68 90 top
R68  25.72,18.1 270 top
R71  31.11,18.1 270 top
TCXO1  23.5,43.18 90 top
TR1  36.83,65.72 270 top
TR2  51.75,65.09 270 top
TR3  8.89,17.78 90 top
U1  10.16,36.2 90 top
U2  6.35,25.4 0 top
U3  55.88,48.26 90 top
U4  46.99,37.15 180 top
U5  33.02,27.94 270 top
U6  15.88,52.07 270 top
U7  46.35,26.67 180 top
U12  44.45,49.85 90 top
U$1  16.51,6.99 0 top
X1  73.66,66.36 270 top
X2  60.96,12.7 180 top
X3  37.47,7.62 90 top
X4  35.56,7.62 90 top
X5  43.18,9.21 0 top
X6  33.66,7.62 90 top

### Tracks (layer width: path | path; a pad name or v marks a point on that pad's centre or on a via)
3.3VBEACON  (via drill 0.4)
  Top 0.254: U5.1 37.66,33.74 C14.1 | U5.64 38.82,32.47 39.37,33.02 40.96,33.02 | U4.8 48.93,35.8 C21.1 | R68.2 25.6,17.35 25.4,17.14 | v49.53,24.13 49.53,25.4
  Top 0.279: R30.2 17.98,20.52 17.78,20.32 | R68.2 R71.2
  Top 0.406: 17.78,27.94 17.78,28.26 16.51,29.21 13.97,29.21 R34.2 | R31.2 17.78,26.99 | R19.2 47.1,25.17 U7.5 47.34,25.4 49.53,25.4 | 37.66,33.74 40.44,33.74 C15.1
  Top 0.61: C27.1 L11.1 35.56,52.07 38.73,48.9 C34.1 U12.5 43.15,47.02 44.45,45.72 49.53,45.72 54.61,40.64 54.61,36.83 | 54.61,36.83 54.61,30.48 | 54.61,30.48 54.61,26.67 | 54.61,26.67 54.61,20.95 50.8,17.14 25.4,17.14 20.32,17.14 17.78,19.68 17.78,20.32 17.78,26.99 17.78,27.94 | C21.1 54.18,36.4 54.61,36.83 | U7.5 53.31,25.37 54.61,26.67 | 54.61,30.48 53.98,29.84 43.5,29.84 41.27,32.07 41.27,33.02 C15.1 40.96,33.02
  Bottom 0.254: X5.4 41.91,13.97 45.72,16.83 45.72,21.59 v49.53,24.13
ADC0  (via drill 0.4)
  Top 0.279: U5.59 40.94,29.19 v41.27,29.53 | v44.45,35.88 45.4,36.83 46.35,36.83 46.67,36.51 46.67,35.8 U4.6
  Top 0.305: U4.7 U4.6
  Bottom 0.279: v41.27,29.53 42.23,29.53 44.13,31.43 44.13,35.56 v44.45,35.88
ADC1  (via drill 0.4)
  Top 0.279: U5.60 39.85,29.69 v40.64,30.48 | v44.77,37.47 46.99,37.47 47.31,37.78 47.31,38.42
  Top 0.305: U4.1 47.39,38.5 47.31,38.42 | U4.2 47.31,38.42 | 47.31,38.42
  Bottom 0.279: v40.64,30.48 41.91,30.48 43.18,31.75 43.18,35.88 v44.77,37.47
BEACON_-FAULT  (via drill 0.4)
  Top 0.305: U3.8 53.28,45.78 v57.15,41.91 | v61.91,41.27 61.91,20 65.41,16.51 65.41,12.77 X2.2
  Bottom 0.305: v57.15,41.91 61.28,41.91 v61.91,41.27
BEACON_CE
  Top 0.254: U6.24 12.55,48.74 12.38,48.58 12.38,45.72 13.02,45.09 13.02,41.27 15.24,39.05 15.88,39.05 16.19,38.73 16.19,34.61 19.68,31.11 19.68,30.16 22.66,27.19 U5.26
BEACON_CPOUT
  Top 0.254: U6.42 24,51.82 C70.1 R29.2 R32.2
BEACON_DATA
  Top 0.254: U6.34 17.62,47.63 arc55 17.76,47.37 19.55,46.13 arc-55 19.68,45.87 19.68,36.64 arc45 19.78,36.42 23.4,32.8 arc-45 23.5,32.57 23.5,31.56 arc45 23.59,31.34 25.14,29.78 arc45 25.37,29.69 U5.21
BEACON_OFF
  Top 0.305: C19.1 63.18,20.64 66.67,17.14 66.67,12.7 X2.1
  Top 0.61: U3.3 60.01,48.9 60.44,48.46 R18.2 C19.1
BEACON_RFOUT
  Top 0.254: 17.12,60.19 C22.1 | L7.1 17.12,58.42
  Top 0.305: U6.4 17.12,58.42 17.12,60.19
BEACON_SCL  (via drill 0.4)
  Top 0.254: 19.57,22.63 19.57,21.07 v21.59,19.05 | v21.91,16.19 51.75,16.19 v52.07,16.51 | v59.05,16.19 59.05,12.73 X2.7
  Top 0.305: R26.1 19.57,22.63 R30.1
  Bottom 0.254: v21.59,19.05 21.59,16.51 v21.91,16.19 | v52.07,16.51 53.34,17.78 57.47,17.78 v59.05,16.19
BEACON_SCLK
  Top 0.254: U6.28 14.62,47.74 arc45 14.72,47.51 15.46,46.77 arc-45 15.56,46.54 15.56,42.68 arc45 15.65,42.45 16.1,42 arc45 16.32,41.91 18.28,41.91 arc-45 18.51,41.82 18.64,41.69 arc-45 18.73,41.46 18.73,36.64 arc45 18.82,36.42 22.77,32.48 arc-45 22.86,32.25 22.86,31.25 arc45 22.95,31.02 24.69,29.28 arc45 24.92,29.19 U5.22
BEACON_SDA  (via drill 0.4)
  Top 0.254: R27.1 19.05,25.4 18.73,25.08 18.73,20.32 v19.68,19.37 | v20.32,15.56 20.64,15.24 52.39,15.24 v52.7,15.56 | v57.78,15.56 57.78,12.75 X2.8
  Top 0.305: R27.1 19.25,26.79 19.68,26.99 R31.1
  Bottom 0.254: v19.68,19.37 19.68,16.19 v20.32,15.56 | v52.7,15.56 53.98,16.83 56.52,16.83 v57.78,15.56
BEACON_SDATA
  Top 0.254: U6.26 13.65,48.77 13.65,46.67 14.29,46.04 14.29,41.91 15.56,40.64 17.14,40.64 17.46,40.32 17.46,35.88 21.59,31.75 21.59,30.48 23.88,28.19 U5.24
BEACON_SLE
  Top 0.254: U6.25 13.12,45.93 13.65,45.4 13.65,41.59 15.24,40.01 16.51,40.01 16.83,39.69 16.83,35.24 20.64,31.43 20.64,30.16 23.11,27.69 U5.25
BEACON_SREAD
  Top 0.254: U6.27 14.12,47.28 arc45 14.22,47.06 14.83,46.45 arc-45 14.92,46.22 14.92,42.36 arc45 15.02,42.13 15.78,41.37 arc45 16.01,41.27 17.65,41.27 arc-45 17.87,41.18 18,41.05 arc-45 18.1,40.83 18.1,36.33 arc45 18.19,36.1 22.13,32.16 arc-45 22.23,31.94 22.23,30.93 arc45 22.32,30.7 24.24,28.78 arc45 24.46,28.69 U5.23
BEACON_TCXO
  Top 0.254: U6.39 20.91,50.32 arc-90 C77.2
BEACON_TXCLK
  Top 0.254: U6.35 18.12,48.08 arc55 18.26,47.82 20.19,46.45 arc-55 20.32,46.19 20.32,36.96 arc45 20.41,36.74 24.04,33.11 arc-45 24.13,32.89 24.13,31.88 arc45 24.22,31.66 25.6,30.28 arc45 25.82,30.19 U5.20
BEACON_VCOIN  (via drill 0.3)
  Top 0.254: R29.1 C68.1 25.72,55.24 25.4,55.56 24.45,55.56 v24.13,55.88 | v19.68,55.88 19.05,55.88 18.62,55.77 U6.1
  Bottom 0.254: v24.13,55.88 v19.68,55.88
GND  (via drill 0.3, 0.4, 0.6)
  Top 0.254: C70.2 24,53.32 24.13,53.66 20.64,53.66 U6.45 16.64,53.32 16.62,53.34 | U6.6 16.12,53.73 16.51,53.34 | 16.51,53.34 16.51,52.7 U6.EXP | U6.5 16.62,53.34 | 16.62,53.34 16.62,52.82 | 16.62,52.82 U6.EXP | U6.7 15.62,52.32 U6.EXP | U6.12 13.12,54.82 U6.EXP | U6.19 15.24,51.82 | 15.24,51.82 15.62,51.82 U6.EXP | U6.22 13.74,50.32 14.73,51.31 | 14.73,51.31 15.24,51.82 | U6.29 15.12,50.91 14.73,51.31 | 16.62,52.82 16.62,52.19 16.51,52.07 | U6.47 17.49,54.32 16.51,53.34 | R20.2 C12.2 | C13.2 R21.2 | U5.53 37.63,26.19 37.15,26.67 37.15,30.48 37.47,30.8 38.71,30.8 U5.62 | 31.75,50.8 31.63,51.34 | 16.51,44.45 16.6,44.25
  Top 0.279: U5.63 37.86,31.19 37.47,30.8 | LED1.C 29.96,6.87 v29.21,7.62
  Top 0.305: v31.75,31.75 31.75,33.72 U5.11 | C60.2 v16.83,43.18
  Top 0.406: TCXO1.1 TCXO1.2 | C58.2 26.79,49.21 C59.2 | X6.1 32.91,6.87 LED1.C
  Top 0.61: U1.3 6.67,36.2 | U3.4 61.08,50.16 R18.1 C19.2 | X2.3 64.08,9.47 63.5,8.89 | X2.6 60.34,9.52 60.96,8.89 | U12.2 44.45,49.85 44.45,52.7
  Top 1.27: 6.67,36.2 U1.6
  Bottom 0.305: C16.2 31.95,31.55 v31.75,31.75
  other vias: 15.88,52.07 31.75,68.58 15.88,53.02 16.83,53.02 16.83,52.07 14.92,52.07 14.92,53.02 14.92,51.12 15.88,51.12 16.83,51.12 31.75,71.12 26.67,71.12 26.67,68.58 21.59,68.58 21.59,71.12 16.51,71.12 17.78,68.58 15.24,60.96 12.7,69.85 10.16,67.31 7.62,64.77 12.7,63.5 10.16,63.5 15.24,66.04 35.88,71.12 35.88,68.26 39.05,71.12 38.1,68.26 43.18,68.58 46.35,68.58 46.35,74.3 44.45,74.3 52.7,71.44 52.7,74.3 52.7,68.58 58.1,68.58 60.33,68.58 60.96,71.12 66.04,71.12 71.12,71.12 76.2,71.12 78.11,66.99 78.11,62.55 73.66,61.91 68.58,61.91 64.77,61.91 61.28,61.91 59.69,64.45 55.88,64.45 50.16,62.23 53.98,62.23 46.99,64.45 43.18,64.45 39.69,64.45 38.73,61.59 36.83,59.69 34.92,59.69 32.7,61.91 30.16,61.91 27.62,61.91 19.05,64.45 19.05,60.96 21.91,62.23 24.45,62.23 26.35,45.72 26.35,44.77 26.35,41.59 26.35,40.64 31.75,53.34 29.53,57.78 20.32,48.26 24.13,54.29 8.89,80.01 12.7,80.01 16.51,80.01 20.32,80.01 24.13,80.01 27.94,80.01 31.75,80.01 35.56,80.01 39.37,80.01 43.18,80.01 46.99,80.01 50.8,80.01 54.61,80.01 58.42,80.01 62.23,80.01 66.04,80.01 69.85,80.01 73.66,80.01 73.66,76.2 73.66,73.66 78.74,73.66 8.89,76.2 6.35,73.66 2.54,73.66 2.54,69.85 2.54,64.77 2.54,59.69 2.54,54.61 2.54,49.53 2.54,44.45 2.54,39.37 2.54,33.02 2.54,27.94 2.54,22.86 2.54,19.05 2.54,13.97 2.54,8.89 7.62,8.89 12.7,8.89 12.7,11.43 7.62,11.43 7.62,55.88 10.16,43.18 12.06,43.18 8.89,30.48 15.24,36.83 13.97,38.1 10.79,30.48 10.16,22.86 10.16,21.59 11.11,22.86 11.11,21.59 80.01,55.88 76.2,55.88 72.39,55.88 67.31,55.88 63.5,55.88 59.69,55.88 55.88,55.88 52.07,55.88 48.26,55.88 44.45,55.88 40.64,55.88 38.1,58.42 80.01,59.69 80.01,63.5 80.01,67.31 80.01,71.12 6.35,69.85 10.16,73.66 15.24,74.93 20.32,74.93 25.4,74.93 30.48,74.93 35.56,74.93 40.64,76.2 44.45,77.79 48.26,77.79 52.07,77.79 55.88,76.2 57.15,72.39 71.12,13.97 72.39,13.97 73.66,13.97 74.93,13.97 74.93,15.24 73.66,15.24 72.39,15.24 71.12,15.24 71.12,16.51 72.39,16.51 73.66,16.51 74.93,16.51 33.02,28.57 31.75,28.57 31.75,27.3 33.02,27.3 31.75,41.27 34.29,41.27 38.73,37.78 48.58,27.94 49.53,27.94 48.58,26.99 49.53,26.99 43.5,41.91 43.5,40.32 50.8,38.1 50.8,39.05 40.64,53.34 44.45,53.34 48.26,53.34 52.07,53.34 59.69,53.34 63.5,53.34 67.31,53.34 72.39,53.34 76.2,53.34 80.01,53.34 28.89,52.39 28.26,48.9 32.7,44.45 31.11,44.45 32.7,46.35 21.59,37.78 13.97,24.13 13.97,16.51
  pour Bottom (isolate 0.7, no thermals): 0,82 82,82 82,0 0,0
  pour Top (isolate 0.61, rank 2, no thermals): 82,55 34,55 33,54 33,44 32,43 29,43 28,42 28,37 27,36 16,36 15,35 15,8 0,8 0,82 82,82
  pour Top (isolate 0.61, no thermals): 82.55,53.98 38.1,53.98 38.1,50.8 39.37,49.53 64.77,49.53 64.77,12.7 50.8,12.7 50.8,6.35 74.93,6.35 74.93,0 82.55,0
  pour Top (isolate 0.406): 30.48,41.91 41.91,41.91 43.18,43.18 49.53,43.18 52.07,40.64 52.07,24.13 49.53,21.59 27.94,21.59 26.67,22.86 26.67,33.02 29.21,35.56 29.21,40.64
I2CSEC_SCL  (via drill 0.4)
  Top 0.254: R71.1 49.65,18.85 v51.12,20.32 | v62.87,16.51 62.87,12.73 X2.4
  Top 0.305: R67.1 31.03,18.93 R71.1
  Bottom 0.254: v51.12,20.32 59.05,20.32 v62.87,16.51
I2CSEC_SDA  (via drill 0.4)
  Top 0.254: R63.1 27.3,18.41 27.62,18.1 50.16,18.1 v50.8,18.73 | v61.59,15.56 X2.5
  Top 0.305: R68.1 27.22,18.85 R63.1 | X2.5
  Bottom 0.254: v50.8,18.73 58.42,18.73 v61.59,15.56
N$1
  Top 0.254: R33.2 LED1.A
N$2
  Top 0.61: R1.2 30.16,66.36 | 30.16,66.36 C1.1 | R3.2 30.16,66.36
N$3
  Top 0.61: 34.29,66.36 C1.2 32.5,64.77 R5.2 | 34.29,66.36 35.31,66.36 TR1.B | R4.1 34.29,66.36
N$4
  Top 0.61: TR1.C 38.79,66.48 L1.P$2 42.94,66.48 C3.1
N$5
  Top 0.61: C2.1 35.88,62.66 | 35.88,62.66 R6.2 | TR1.E 35.63,62.91 35.88,62.66
N$6
  Top 0.61: C3.2 C4.1
N$7
  Top 0.61: TR2.B 48.26,66.59 | 48.26,66.59 47.97,66.59 C4.2 | L4.1 48.26,66.59
N$8
  Top 0.61: R7.1 L4.2 | R7.1 49.94,71.32 C5.1 | R7.1 47.51,71.32 46.67,70.48 D1.1
N$9
  Top 0.61: 55.24,66.36 L3.1 | TR2.C 53.98,65.09
  Top 1.016: L2.P$2 55.24,66.36 53.98,65.09
N$10
  Top 0.61: L3.2 C6.1
N$11
  Top 0.61: C6.2 L5.1 | L5.1 62.12,64.68 C7.1 | L5.1 C8.1
N$12
  Top 0.61: C9.1 65.29,65.09 L6.1 64.45,66.36 | L5.2 64.45,66.36 | 64.45,66.36 64.45,68.9 | C8.2 64.45,68.9 | 64.45,68.9 C10.1
N$13
  Top 0.61: C10.2 L6.2 | L6.2 X1.1 | L6.2 66.79,64.77 C11.1
N$14
  Top 0.61: R4.2 R8.1
N$15
  Top 0.61: L1.P$1 R9.1
N$16
  Top 0.61: R10.1 R7.2
N$17
  Top 1.016: L2.P$1 R11.1
N$18
  Top 0.406: R15.1 R14.2 10.28,38.85 U1.5 C25.1
N$19
  Top 0.406: TR3.3 6.99,17.78 | 6.99,17.78 R12.1 | U2.3 6.99,20.32 | 6.99,20.32 6.99,17.78 | C23.1 6.99,20.32
N$20
  Top 0.406: C24.1 5.83,31.23 6.03,31.75 | 10.16,34.29 U1.1
  Top 0.61: U1.2 10.16,34.29 | U2.6 6.35,28 U2.7
  Top 1.016: 6.03,32.38 7.62,34.29 10.16,34.29
  Top 1.27: 6.03,32.38 6.03,31.75 6.03,28.26 6.35,27.94 6.35,28
N$21
  Top 0.305: U2.5 9.46,28 9.84,27.62 9.84,26.47 R13.2
N$22
  Top 0.254: U4.5 46.02,34.74 R21.1 46.99,34.29 | 46.99,34.29 R23.2 | C13.1 46.47,33.77 46.99,34.29
N$23  (via drill 0.4)
  Top 0.305: U5.7 33.77,31.95 v33.97,31.75
  Bottom 0.305: v33.97,31.75 33.97,31.11 33.34,30.48 C16.1 33.66,30.48
N$24  (via drill 0.4)
  Top 0.254: U5.13 30.77,32.36 v30.48,32.07 | v29.84,11.11 31.64,11.11 R33.1
  Bottom 0.254: v30.48,32.07 29.53,32.07 29.21,31.75 29.21,13.02 v29.84,11.11
N$25
  Top 0.254: U5.8 33.27,35.81 arc-90 34.29,36.83 Q2.1
  Top 0.406: Q2.1 34.27,38.6 C17.1
N$26
  Top 0.254: U5.9 32.77,35.83 arc90 Q2.2
  Top 0.406: Q2.2 31.77,38.6 C18.1
N$27  (via drill 0.4)
  Top 0.254: U5.57 43.25,28.19 43.81,27.62 43.81,20.64 v44.13,20.32
  Bottom 0.254: v44.13,20.32 44.13,17.46 38.73,13.65 38.73,11.43 40.01,10.48 43.18,10.48 44.45,9.21 44.45,6.99 44.13,6.67 X5.7
N$28  (via drill 0.4)
  Top 0.254: U5.56 42.48,27.69 43.18,26.99 v43.18,19.68
  Bottom 0.254: v43.18,19.68 42.86,17.78 38.1,14.29 38.1,10.79 40.32,9.21 42.55,9.21 43.18,8.57 X5.5
N$29  (via drill 0.4)
  Top 0.254: U5.55 42.02,27.19 42.55,26.67 42.55,21.27 v41.91,20
  Bottom 0.254: v41.91,20 41.91,18.1 37.47,14.92 37.47,9.84 39.69,8.26 41.59,8.26 41.91,7.94 X5.3
N$30  (via drill 0.4)
  Top 0.254: U5.54 41.57,26.69 41.91,26.35 41.91,21.59 v40.64,20.32
  Bottom 0.254: v40.64,20.32 40.64,18.41 36.83,15.56 36.83,8.89 39.69,6.67 X5.1
N$31  (via drill 0.4)
  Top 0.254: R16.1 46.79,20.2 v46.99,20
  Bottom 0.254: v46.99,20 46.99,13.02 X5.10
N$32
  Top 0.254: U3.5 53.28,51.69 53.66,52.07 R17.2
N$33
  Top 0.254: C12.1 R20.1 46.99,40.01 | R22.2 46.99,40.01 | U4.3 46.66,39.68 46.99,40.01
N$34
  cutout Bottom: 0,82 7,82 7,75 0,75
  cutout Bottom: 75,82 82,82 82,75 75,75
  cutout Bottom: 75,7 82,7 82,0 75,0
  cutout Bottom: 0,7 7,7 7,0 0,0
  cutout Top: 0,82 7,82 7,75 0,75
  cutout Top: 75,82 82,82 82,75 75,75
  cutout Top: 0,7 7,7 7,0 0,0
  cutout Top: 75,7 82,7 82,0 75,0
N$42
  Top 0.61: C22.2 17.14,64.14 arc-90 19.37,66.36 L8.1 20.84,64.77 C54.1
N$43
  Top 0.61: L8.2 23.5,66.36 | 23.5,66.36 L9.1 | C55.1 23.18,66.04 23.5,66.36
N$44
  Top 0.61: C56.1 25.52,64.77 L9.2 R1.1 27.82,64.77 R2.2
N$45
  Top 0.254: U6.48 20.85,54.82 21.27,55.24 21.27,55.68 C62.1
N$46
  Top 0.305: C63.2 R28.2
N$47
  Top 0.254: U6.31 16.12,47.82 arc45 16.22,47.6 16.42,47.4 arc-45 16.51,47.18 16.51,45.52 C60.1
N$48
  Top 0.254: U6.11 13.62,56.23 13.34,56.52 12.18,56.52 C67.1
N$49
  Top 0.254: R25.2 13.34,57.78 14.12,56.99 U6.10
N$50
  Top 0.254: R24.2 12.7,61.28 15.12,58.85 U6.8
N$51
  Top 0.254: U6.41 22.98,51.32 23.5,50.8 25.08,50.8 25.4,50.48 C58.1
N$52
  Top 0.254: C62.2 22.98,56.74 | 22.98,56.74 C63.1 | U6.2 18.12,56.23 18.73,56.83 19.68,56.83 20.32,57.47 22.25,57.47 22.98,56.74
N$53
  Top 0.254: R32.1 C69.1
N$54
  Top 0.254: U6.46 19.53,53.82 20.64,54.29 22.11,54.29 L10.1
N$55
  Top 0.254: U6.44 20.64,53.02 22.54,53.02 22.86,52.7 L10.2 22.23,53.02
N$59
  Top 0.254: U5.33 29.27,20.5 R67.2
N$60
  Top 0.254: U5.29 22.05,25.69 R27.2
N$61
  Top 0.254: U5.31 21.95,24.69 R26.2
N$64
  Top 0.254: U5.32 27.22,20.52 R63.2
N$69
  Top 0.406: TCXO1.3 22.14,47.43 arc-90 C77.1
N$666
  Top 0.254: U12.3 46.99,50.8 46.99,48.9
  Top 0.61: U12.1 46.99,48.9 C35.1 50.6,48.9 C20.1 50.8,48.9 U3.6 U3.7
PA_-FAULT  (via drill 0.4)
  Top 0.254: U5.28 22.07,26.19 v20.95,26.67 | v13.97,26.67 R34.1 | U2.8 4.45,26.35 v5.08,25.72
  Bottom 0.254: v20.95,26.67 v13.97,26.67 13.02,25.72 v5.08,25.72
PA_ON
  Top 0.254: TR3.1 9.85,16.83 9.84,16.83 10.16,16.51 10.48,16.83 11.43,16.83 12.38,17.78 12.38,29.84 13.34,30.8 18.1,30.8 22.2,26.69 U5.27
RESETBEACON
  Top 0.254: R16.2 45.6,21.82 R19.1 45.41,23.7 U7.4 45.41,25.4 45.4,25.4 44.77,25.4 44.45,25.72 44.45,27.94 43.7,28.69 U5.58
RXD  (via drill 0.4)
  Top 0.305: X3.1 37.15,8.26 37.15,11.11 v35.56,12.7 | U5.35 30.27,23.92 30.48,24.13 v33.02,24.13
  Bottom 0.305: v35.56,12.7 33.02,15.24 v33.02,24.13
TXD  (via drill 0.4)
  Top 0.305: X4.1 35.56,11.43 v34.29,12.7 | v31.75,25.4 30.48,25.4 29.77,24.69 U5.34
  Bottom 0.305: v34.29,12.7 31.75,15.24 v31.75,25.4
VBEACON_PA  (via drill 0.3)
  Top 0.279: R22.1 49.33,43.38 48.26,44.45 41.91,44.45 40.64,43.18 30.48,43.18 29.21,41.91 29.21,36.2 27.94,34.92 23.5,34.92 v22.86,35.56 | v13.34,36.2 13.22,36.2 R14.1
  Top 0.406: R14.1 10.28,37.35 U1.4 | C26.1 7.3,45.4 7.62,45.72
  Top 0.813: U1.4 8.26,37.47 | 7.62,46.02 C30.P$1
  Top 1.016: 8.26,37.47 7.62,38.1 7.62,45.72 7.62,46.02 | C30.P$1 7.62,46.37 7.62,49.53 5.08,52.07 5.08,65.09 12.81,72.82 R8.2 R9.2 43.81,76 R10.2 53.34,76 R11.2
  Bottom 0.279: v22.86,35.56 13.97,35.56 v13.34,36.2
VBUS  (via drill 0.3)
  Top 0.254: R12.2 4.65,16.08 4.45,15.88 | R23.1 v53.34,34.29 | v55.88,34.29 58.48,34.29
  Top 0.61: U2.2 U2.1 | X2.9 56.59,14.54 55.88,15.24 54.61,15.24 | U3.1 U3.2
  Top 1.016: U3.1 58.48,34.29 58.48,20.38 54.61,16.51 54.61,15.24 54.61,13.43 X2.10 54.61,12.7 53.34,13.97 6.35,13.97 4.45,15.88 U2.1
  Bottom 0.254: v53.34,34.29 v55.88,34.29
VCCRF  (via drill 0.25, 0.3)
  Top 0.254: U6.32 16.62,48.15 17.05,47.72 arc-45 17.14,47.49 17.14,46.84 arc56 17.29,46.58 17.96,46.13 arc-56 18.1,45.87 18.1,45.72 18.1,44.56 C61.1 | C66.1 v12.7,59.69 | U6.40 22.52,50.82 24.45,48.9 C59.1 | U6.3 17.62,56.81 18.28,57.47 18.73,57.47 19.05,57.78 19.05,58.3 L7.2 | U6.43 20.89,52.32 v20.95,52.39 | v30.16,50.48 30.16,51.87 C57.1
  Top 0.305: 24.45,48.9 24.45,47.94 24.77,47.62 28.89,47.62 | U6.9 14.62,57.77 v12.7,59.69 | v18.73,45.72 18.1,45.72 | v21.27,41.27 21.95,41.27 TCXO1.4
  Top 0.406: 31.11,47.62 31.11,46.99 28.57,44.45 28.57,38.1 26.99,36.51 23.5,36.51 22.75,37.26 C76.1 22.14,39.65 TCXO1.4 | 31.11,47.62 33.97,52.39 33.97,56.83 | 31.11,47.62 28.89,47.62 v30.16,50.48
  Top 0.61: C28.1 L11.2 | L7.2 20.32,59.58 C52.1 C51.1 C65.1 C64.1 31.23,59.58 31.43,59.37
  Top 0.813: L11.2 35.24,55.56 33.97,56.83 31.43,59.37
  Bottom 0.254: v20.95,52.39 21.91,52.39 24.13,50.16 28.57,50.16 v30.16,50.48
  Bottom 0.305: v12.7,59.69 11.43,59.69 10.16,58.42 10.16,46.99 11.43,45.72 v18.73,45.72 18.73,41.91 19.37,41.27 v21.27,41.27